# Altium schematic sheet POWER_GEN.SchDoc: =project_title
size Tabloid; CompanyName: Luxonis Holding; DrawnBy: Brian Weinstein / Sandesh Joshi/Dan Dunga; Organization: Luxonis Holding; Address1: 1925 Harmony Park Drive; Address2: Westminster, CO; Address3: 80234; Address4: United States; SheetNumber: 12; SheetTotal: 15
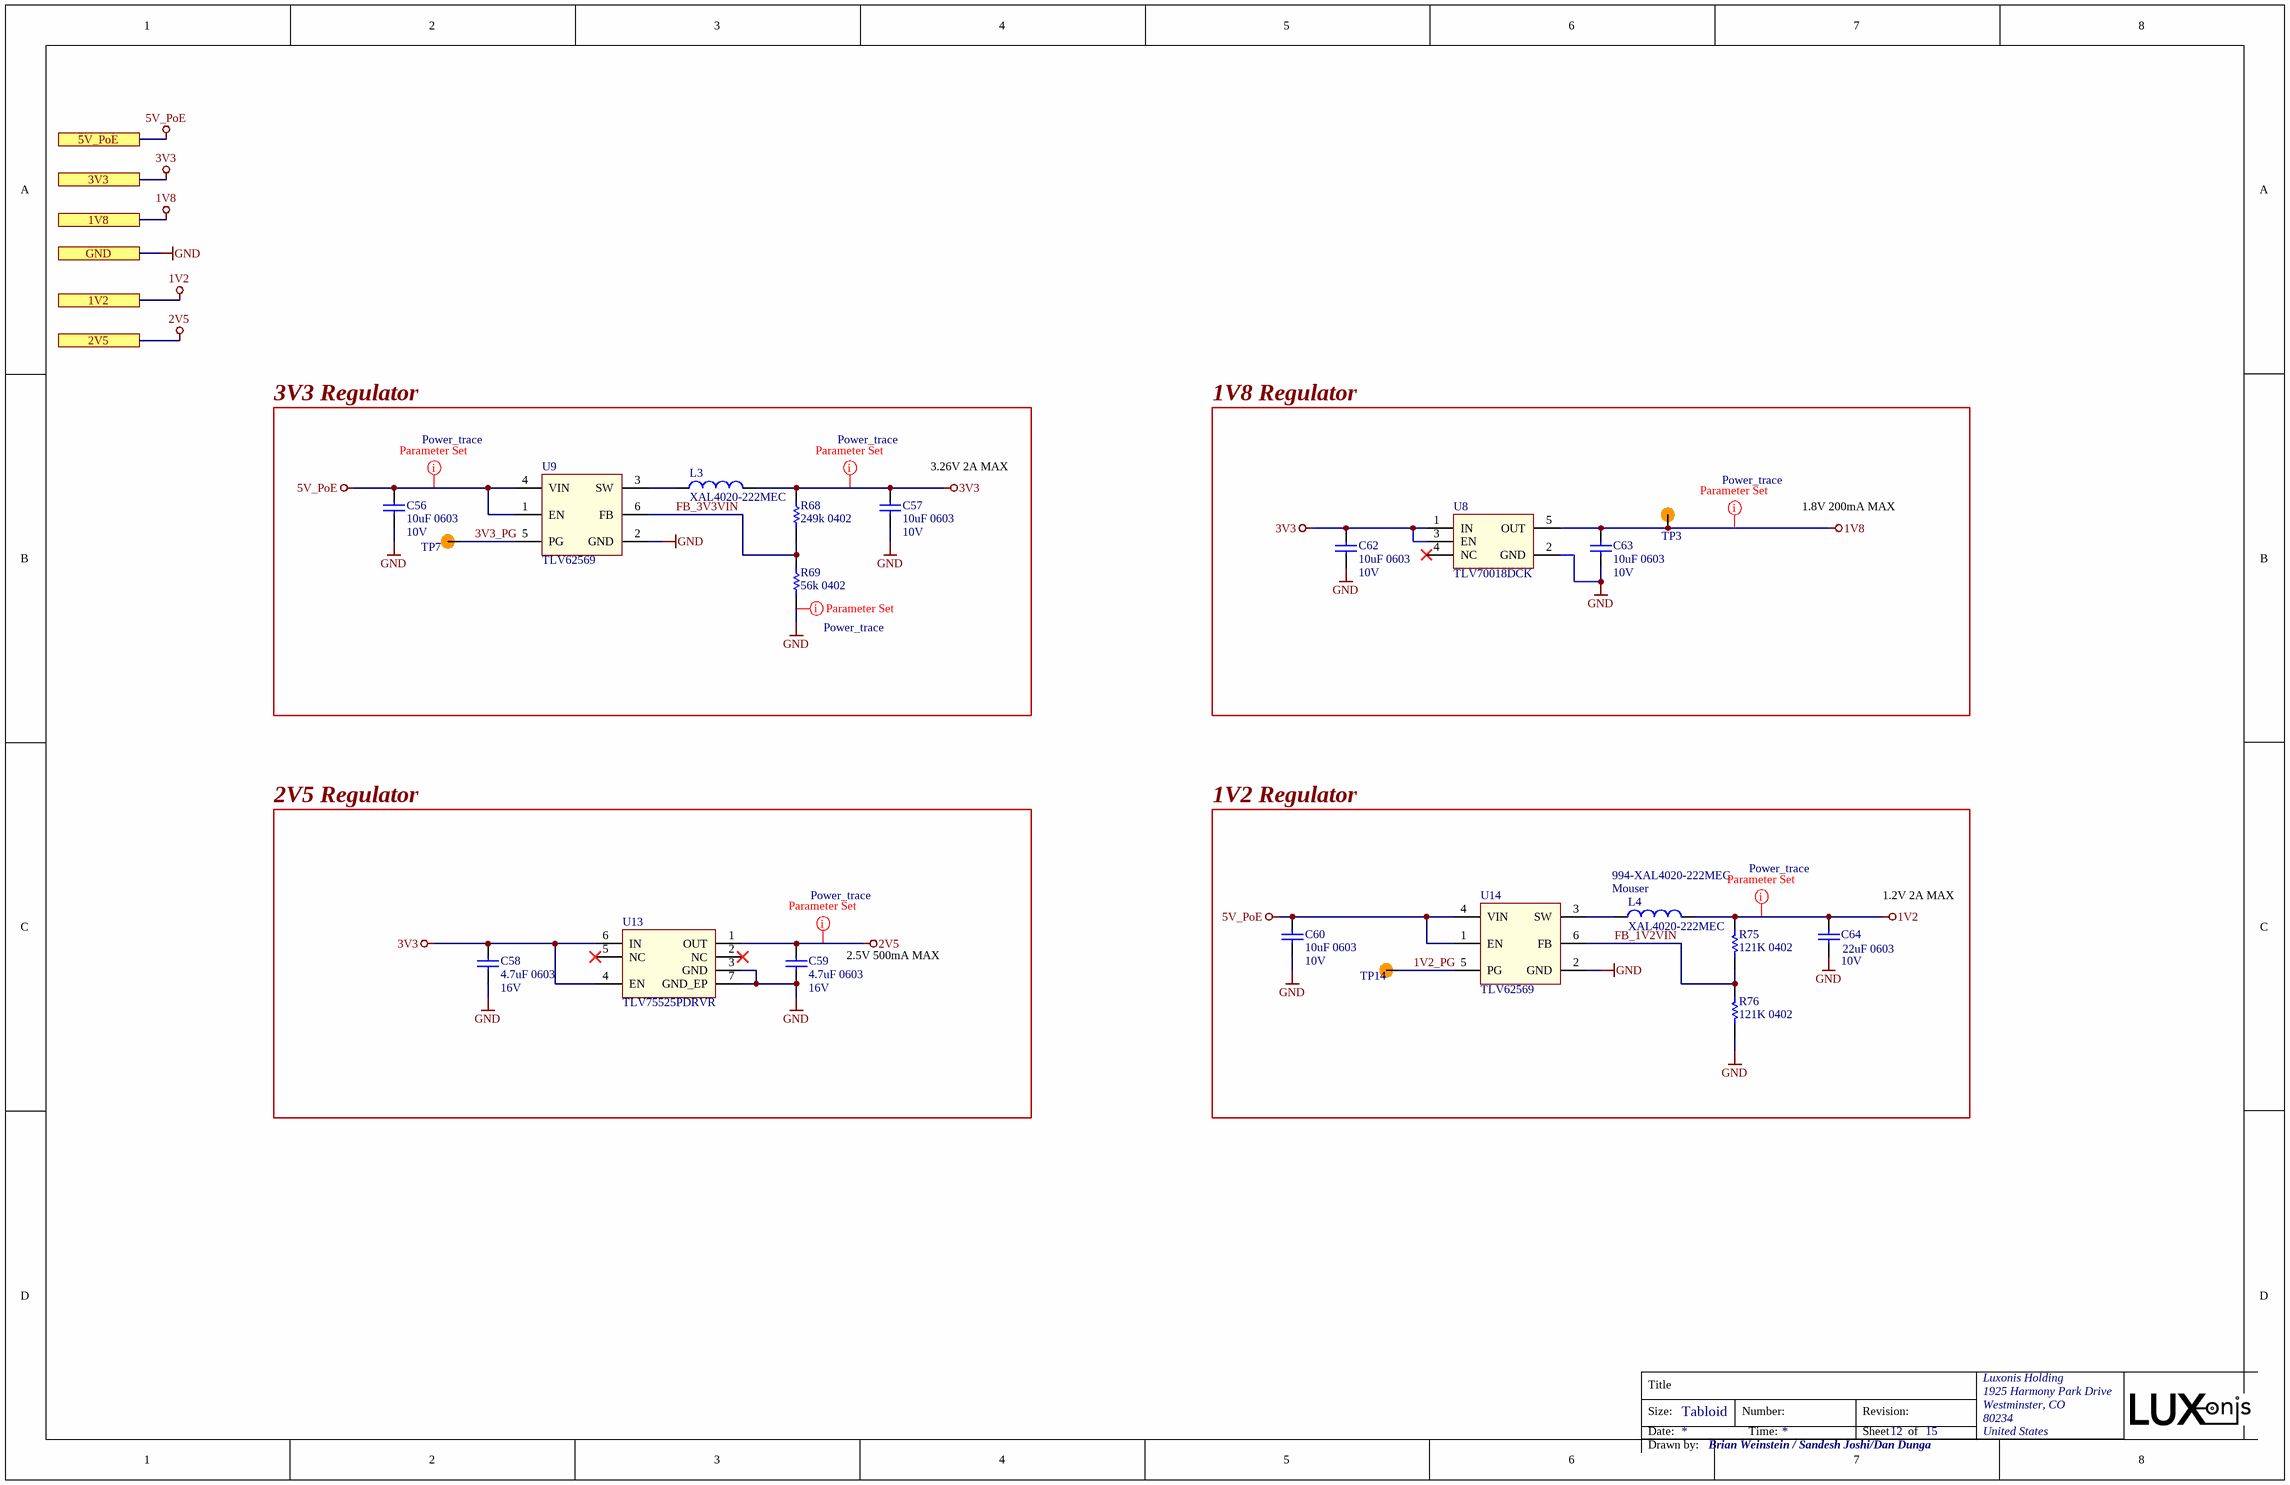
[diagram p0: POWER_GEN.SchDoc]

## Parts
C56  10uF 0603  Voltage Rating: 10V  [CAPC0603(1608)100_N]
C57  10uF 0603  Voltage Rating: 10V  [CAPC0603(1608)100_N]
C58  4.7uF 0603  Voltage Rating: 16V  [CAPC0603(1608)100_N]
C59  4.7uF 0603  Voltage Rating: 16V  [CAPC0603(1608)100_N]
C60  10uF 0603  Voltage Rating: 10V  [CAPC0603(1608)100_N]
C62  10uF 0603  Voltage Rating: 10V  [CAPC0603(1608)100_N]
C63  10uF 0603  Voltage Rating: 10V  [CAPC0603(1608)100_N]
C64  22uF 0603  Voltage Rating: 10V  [CAPC0603(1608)100_N]
L3  XAL4020-222MEC  [XAL4020]
L4  XAL4020-222MEC  Supplier 1: Mouser  Supplier Part Number 1: 994-XAL4020-222MEC  [XAL4020]
R68  249k 0402  [RESC0402(1005)_L]
R69  56k 0402  [RESC0402(1005)_L]
R75  121K 0402  [RESC0402(1005)_N]
R76  121K 0402  [RESC0402(1005)_N]
TP3  TP100_200_NS  [TP100_200_NS]  (value not drawn)  (no BOM)
TP7  TP100_200_NS  [TP100_200_NS]  (value not drawn)  (no BOM)
TP14  TP100_200_NS  [TP100_200_NS]  (value not drawn)  (no BOM)
U8  TLV70018DCK  [TLV70018DCK]
U9  TLV62569  [SOT236]
U13  TLV75525PDRVR  [WSON-6]
U14  TLV62569  [SOT236]

## Blocks framed on the sheet
3V3 Regulator: C56 C57 L3 R68 R69 TP7 U9
1V8 Regulator: C62 C63 TP3 U8
2V5 Regulator: C58 C59 U13
1V2 Regulator: C60 C64 L4 R75 R76 TP14 U14

## Ports
1V2, 1V8, 2V5, 3V3, 5V_PoE, GND

## Nets
1V2: C64.2 L4.2 R75.1 ; port 1V2
1V8: C63.2 TP3.1 U8.5(OUT) ; port 1V8
2V5: C59.2 U13.1(OUT) ; port 2V5
3V3: C57.2 C58.2 C62.2 L3.2 R68.2 U8.1(IN) U8.3(EN) U13.4(EN) U13.6(IN) ; port 3V3
5V_PoE: C56.2 C60.2 U9.1(EN) U9.4(VIN) U14.1(EN) U14.4(VIN) ; port 5V_PoE
GND: C56.1 C57.1 C58.1 C59.1 C60.1 C62.1 C63.1 C64.1 R69.1 R76.2 U8.2(GND) U9.2(GND) U13.3(GND) U13.7(GND_EP) U14.2(GND) ; port GND
1V2_PG: TP14.1 U14.5(PG)
3V3_PG: TP7.1 U9.5(PG)
FB_1V2VIN: R75.2 R76.1 U14.6(FB)
FB_3V3VIN: R68.1 R69.2 U9.6(FB)
NetL3_1: L3.1 U9.3(SW)
NetL4_1: L4.1 U14.3(SW)

Not connected (* = marked no-connect by the designer): U8 4(NC)*; U13 2(NC)* 5(NC)*

## Layout directives
net class Power_trace: 1V2, 1V8, 2V5, 3V3, 5V_PoE, GND

## Notes on the sheet
- (near C57) 3.26V 2A MAX
- 1.8V 200mA MAX
- 1.2V 2A MAX
- (near C59) 2.5V 500mA MAX
- Title
- Size:
- Date:
- Tabloid
- Number:
- Time:
- Revision:
- Sheet
- of
- Drawn by:

## Library data of the parts
C56 C57 C60 C62 C63 = GRM188R61A106ME69D: CAP CER 10UF 10V X5R 0603 20%; Manufacturer 1: Murata; Material: Ceramic; Supplier 1: Digi-Key; Manufacturer Part Number 1: GRM188R61A106ME69D; Stock 1: 2873098; Pricing 1: 1=0.21000, 10=0.14100, 100=0.07130, 500=0.04876, 1000=0.04313 (USD); RoHS: Yes; Mount: Surface Mount; Case/Package: 0603; Weight: 0.000222oz; Case Code (Metric): 1608; Case Code (Imperial): 0603; Min Operating Temperature: -55°C; Max Operating Temperature: 85°C; Packaging: Tape and Reel; Tolerance: 20%; Capacitance: 10uF; Dielectric: X5R; Voltage Rating (DC): 10V; Package Quantity: 4000; Termination: SMD/SMT; Length: 1.6mm; Height: 0.8mm; Width: 0.8mm; Thickness: 0.035inch; Depth: 0.8mm; REACH SVHC: Unknown; Lead Free: Lead Free; ComponentLink1URL: http://www.mouser.com/ds/2/281/c02e-2905.pdf?src-supplier=Mouser; ComponentLink1Description: http://www.mouser.com/ds/2/281/c02e-2905.pdf?src-supplier=Mouser; ComponentLink2URL: http://components.arrow.com/part/dataview/0323_06119472?src-supplier=Arrow+Europe; ComponentLink2Description: http://components.arrow.com/part/dataview/0323_06119472?src-supplier=Arrow+Europe; ComponentLink3URL: http://www.farnell.com/datasheets/2048014.pdf?src-supplier=Farnell; ComponentLink3Description: http://www.farnell.com/datasheets/2048014.pdf?src-supplier=Farnell; ComponentLink4URL: http://www.farnell.com/datasheets/1872210.pdf?src-supplier=Farnell; ComponentLink4Description: http://www.farnell.com/datasheets/1872210.pdf?src-supplier=Farnell; ComponentLink5URL: http://search.murata.co.jp/Ceramy/image/img/A01X/G101/ENG/GRM188R61A106ME69-01.pdf?src-supplier=Digi-Key; ComponentLink5Description: http://search.murata.co.jp/Ceramy/image/img/A01X/G101/ENG/GRM188R61A106ME69-01.pdf?src-supplier=Digi-Key; ComponentLink6URL: http://www.farnell.com/datasheets/1872210.pdf?src-supplier=Newark; ComponentLink6Description: http://www.farnell.com/datasheets/1872210.pdf?src-supplier=Newark; ComponentLink7URL: http://www.farnell.com/datasheets/2048014.pdf?src-supplier=Element14; ComponentLink7Description: http://www.farnell.com/datasheets/2048014.pdf?src-supplier=Element14; ComponentLink8URL: http://www.farnell.com/datasheets/2048014.pdf?src-supplier=Newark; ComponentLink8Description: http://www.farnell.com/datasheets/2048014.pdf?src-supplier=Newark; Supplier Part Number 1: 490-10475-1-ND
C58 C59 = GRM188R61C475KAAJD: CAP CER 4.7UF 16V X5R 0603 10%; Manufacturer 1: Murata; Material: Ceramic; Supplier 1: Digi-Key; Manufacturer Part Number 1: GRM188R61C475KAAJD; Stock 1: 455058; Pricing 1: 1=0.35000, 10=0.24600, 100=0.14730, 500=0.11050, 1000=0.09331 (USD); RoHS: Yes; Mount: Surface Mount; Case/Package: 0603; Weight: 0.000222oz; Case Code (Metric): 1608; Case Code (Imperial): 0603; Min Operating Temperature: -55°C; Max Operating Temperature: 85°C; Capacitance: 4.7uF; Tolerance: 10%; Packaging: Tape and Reel; Dielectric: X5R; Termination: SMD/SMT; Voltage Rating (DC): 16V; Package Quantity: 4000; Length: 1.6mm; Height: 0.8mm; Width: 0.8mm; Thickness: 0.037inch; Depth: 0.8mm; REACH SVHC: No SVHC; Lead Free: Lead Free; ComponentLink1URL: https://datasheet.ciiva.com/14813/595grm188r61c475kaaj23-14813668.pdf?src-supplier=Arrow; ComponentLink1Description: https://datasheet.ciiva.com/14813/595grm188r61c475kaaj23-14813668.pdf?src-supplier=Arrow; Supplier 2: Digi-Key; Manufacturer 2: Murata; Manufacturer Part Number 2: GRM188R61C475KAAJD; Stock 2: 455058; Pricing 2: 1=0.35000, 10=0.24600, 100=0.14730, 500=0.11050, 1000=0.09331 (USD); Supplier 3: Digi-Key; Manufacturer 3: Murata; Manufacturer Part Number 3: GRM188R61C475KAAJD; Stock 3: 452000; Pricing 3: 4000=0.07259, 8000=0.06832, 12000=0.06619, 28000=0.06405 (USD); Supplier Part Number 1: 490-10481-1-ND; Supplier Part Number 2: 490-10481-6-ND; Supplier Part Number 3: 490-10481-2-ND
C64 = GRM188R61A226ME15D: CAP CER 22UF 10V X5R 0603 20%; Manufacturer 1: Murata; Material: Ceramic; ComponentLink1URL: https://datasheet.ciiva.com/46444/1769893-46444975.pdf?src-supplier=Element14; ComponentLink1Description: https://datasheet.ciiva.com/46444/1769893-46444975.pdf?src-supplier=Element14; Supplier 1: Digi-Key; Manufacturer Part Number 1: GRM188R61A226ME15D; Stock 1: 984716; Pricing 1: 1=0.31000, 10=0.21500, 100=0.12160, 500=0.08584, 1000=0.07512 (USD); RoHS: Yes; Mount: Surface Mount; Case/Package: 0603; Weight: 0.000222oz; Case Code (Metric): 1608; Case Code (Imperial): 0603; Min Operating Temperature: -55°C; Max Operating Temperature: 85°C; Capacitance: 22uF; Tolerance: 20%; Packaging: Tape and Reel; Dielectric: X5R; Voltage Rating (DC): 10V; Termination: SMD/SMT; Package Quantity: 4000; Length: 1.6mm; Height: 0.8mm; Width: 0.8mm; Thickness: 0.039inch; Depth: 0.8mm; REACH SVHC: No SVHC; Lead Free: Lead Free; Supplier Part Number 1: 490-10476-1-ND
L3 L4 = XAL4020-222MEC: INDUCTOR, 2.2UH, 5.5A,20%,52MHZ, REEL; Manufacturer 1: Coilcraft; Core Material: Composite; Shielding: Shielded; DC Resistance (DCR): 38.7mR; Test Frequency: 100kHz; Saturation Current: 5.6A; Manufacturer Part Number 1: XAL4020-222MEC; RoHS: Yes; Category: Fixed Inductors; Stock 1: 45163; Pricing 1: 1=1.68000, 100=1.37000, 250=1.03000, 500=0.62000, 1000=0.48000, 3000=0.41000 (USD); Mount: Surface Mount; Case/Package: SMD/SMT; Min Operating Temperature: -40°C; Max Operating Temperature: 125°C; Packaging: Tape and Reel; Tolerance: 20%; Self Resonant Frequency: 52MHz; Inductance: 2.2uH; Max DC Current: 5.5A; Termination: SMD/SMT; Package Quantity: 1000; Inductance Tolerance: 20%; RMS Current (Irms): 5.5A; Series: XAL4020; Length: 4.3mm; Width: 4.3mm; Height: 2.1mm; Lead Free: Contains Lead; RoHS Compliant: Yes; REACH SVHC: Unknown; ComponentLink1URL: https://datasheet.ciiva.com/13277/xal4000-270751-13277338.pdf?src-supplier=Mouser; ComponentLink1Description: https://datasheet.ciiva.com/13277/xal4000-270751-13277338.pdf?src-supplier=Mouser; ComponentLink2URL: https://datasheet.ciiva.com/22680/1681987-22680732.pdf?src-supplier=Element14; ComponentLink2Description: https://datasheet.ciiva.com/22680/1681987-22680732.pdf?src-supplier=Element14; ComponentLink3URL: https://datasheet.ciiva.com/22680/1681987-22680733.pdf?src-supplier=Element14; ComponentLink3Description: https://datasheet.ciiva.com/22680/1681987-22680733.pdf?src-supplier=Element14
  L3: Supplier 1: Mouser; Supplier Part Number 1: 994-XAL4020-222MEC
R68 = CRCW0402249KFKED: RES SMD 249K OHM 1% 1/16W 0402; Manufacturer 1: Vishay; Resistance: 249kR; Temperature Coefficient: 100ppm/°C; Max Power Dissipation: 63mW; Voltage Rating (DC): 50V; Supplier 1: Digi-Key; Manufacturer Part Number 1: CRCW0402249KFKED; Stock 1: 241; Pricing 1: 1=0.10000, 10=0.03800, 100=0.01540, 1000=0.00690, 2500=0.00599, 5000=0.00495 (USD); RoHS: Yes; Case/Package: 0402; Weight: 2.3E-05oz; Case Code (Metric): 1005; Case Code (Imperial): 0402; Contact Plating: Tin; Min Operating Temperature: -55°C; Max Operating Temperature: 155°C; Tolerance: 1%; Packaging: Tape and Reel; Composition: Thick Film; Number of Terminations: 2; Package Quantity: 10; Power Rating: 63mW; Voltage Rating: 50V; Military Standard: Not; Features: Automotive AEC-Q200; Termination: SMD/SMT; Length: 1mm; Height: 0.35mm; Width: 0.02inch; Depth: 0.5mm; Lead Free: Lead Free; REACH SVHC: Unknown; ComponentLink1URL: https://datasheet.ciiva.com/11809/0900766b80d98824-11809983.pdf?src-supplier=RSComponents; ComponentLink1Description: https://datasheet.ciiva.com/11809/0900766b80d98824-11809983.pdf?src-supplier=RSComponents; ComponentLink2URL: https://datasheet.ciiva.com/22871/70201119-22871976.pdf?src-supplier=Allied+Electronics; ComponentLink2Description: https://datasheet.ciiva.com/22871/70201119-22871976.pdf?src-supplier=Allied+Electronics; ComponentLink3URL: https://datasheet.ciiva.com/22709/1697337-22709034.pdf?src-supplier=Element14; ComponentLink3Description: https://datasheet.ciiva.com/22709/1697337-22709034.pdf?src-supplier=Element14; ComponentLink4URL: https://datasheet.ciiva.com/7673/1697337-7673998.pdf?src-supplier=Element14; ComponentLink4Description: https://datasheet.ciiva.com/7673/1697337-7673998.pdf?src-supplier=Element14; ComponentLink5URL: https://datasheet.ciiva.com/2463/dcrcwe3-2463808.pdf?src-supplier=Digi-Key; ComponentLink5Description: https://datasheet.ciiva.com/2463/dcrcwe3-2463808.pdf?src-supplier=Digi-Key; ComponentLink6URL: https://datasheet.ciiva.com/2463/dcrcwe3-2463809.pdf?src-supplier=Digi-Key; ComponentLink6Description: https://datasheet.ciiva.com/2463/dcrcwe3-2463809.pdf?src-supplier=Digi-Key; ComponentLink7URL: https://datasheet.ciiva.com/5542/dcrcwe3-109170-5542680.pdf?src-supplier=Mouser; ComponentLink7Description: https://datasheet.ciiva.com/5542/dcrcwe3-109170-5542680.pdf?src-supplier=Mouser; ComponentLink8URL: https://datasheet.ciiva.com/16774/70201119-16774040.pdf?src-supplier=Allied+Electronics; ComponentLink8Description: https://datasheet.ciiva.com/16774/70201119-16774040.pdf?src-supplier=Allied+Electronics; ComponentLink9URL: https://datasheet.ciiva.com/7743/125364-7743531.pdf?src-supplier=Element14; ComponentLink9Description: https://datasheet.ciiva.com/7743/125364-7743531.pdf?src-supplier=Element14; ComponentLink10URL: https://datasheet.ciiva.com/7673/1697337-7673997.pdf?src-supplier=Element14; ComponentLink10Description: https://datasheet.ciiva.com/7673/1697337-7673997.pdf?src-supplier=Element14; Supplier 2: Digi-Key; Manufacturer 2: Vishay; Manufacturer Part Number 2: CRCW0402249KFKED; Stock 2: 241; Pricing 2: 1=0.10000, 10=0.03800, 100=0.01540, 1000=0.00690, 2500=0.00599, 5000=0.00495 (USD); Supplier Part Number 2: 541-249KLDKR-ND; Supplier Part Number 1: 541-249KLCT-ND
R69 = CRCW040256K0FKED: VISHAY - CRCW040256K0FKED - RES, THICK FILM, 56K, 1%, 0.063W, 0402; Resistance: 56kR; Power Rating: 63mW; Voltage Rating: 50V; Temperature Coefficient: 100ppm/°C; Manufacturer 1: Vishay; Manufacturer Part Number 1: CRCW040256K0FKED; RoHS: Yes; Category: Chip SMD Resistors; Stock 1: 180000; Pricing 1: 10000=0.00500 (USD); Mount: Surface Mount; Case/Package: 0402; Number of Pins: 2; Case Code (Metric): 1005; Case Code (Imperial): 0402; Contact Plating: Tin; Weight: 2.3E-05oz; Size Code: 0402; Min Operating Temperature: -55°C; Max Operating Temperature: 155°C; Package Quantity: 10; Tolerance: 1%; Packaging: Tape and Reel; Resistor Type: Thick Film; Termination: SMD/SMT; Voltage Rating (DC): 50V; Number of Terminations: 2; Max Power Dissipation: 63mW; Series: CRCW; Resistance Tolerance: 1%; Construction: Rectangular; Features: Automotive AEC-Q200; Technology: THICK FILM; Length: 1mm; Width: 0.02inch; Height: 0.35mm; Depth: 0.5mm; Radiation Hardening: No; REACH SVHC: Unknown; Military Standard: Not; RoHS Compliant: Yes; Lead Free: Lead Free; ComponentLink1URL: https://datasheet.ciiva.com/11811/0900766b80d98824-11811649.pdf?src-supplier=RSComponents; ComponentLink1Description: https://datasheet.ciiva.com/11811/0900766b80d98824-11811649.pdf?src-supplier=RSComponents; ComponentLink2URL: https://datasheet.ciiva.com/2525/dcrcwe3-2525584.pdf?src-supplier=Digi-Key; ComponentLink2Description: https://datasheet.ciiva.com/2525/dcrcwe3-2525584.pdf?src-supplier=Digi-Key; ComponentLink3URL: https://datasheet.ciiva.com/2525/dcrcwe3-2525585.pdf?src-supplier=Digi-Key; ComponentLink3Description: https://datasheet.ciiva.com/2525/dcrcwe3-2525585.pdf?src-supplier=Digi-Key; ComponentLink4URL: https://datasheet.ciiva.com/2525/dcrcwe3-2525586.pdf?src-supplier=Digi-Key; ComponentLink4Description: https://datasheet.ciiva.com/2525/dcrcwe3-2525586.pdf?src-supplier=Digi-Key; ComponentLink5URL: https://datasheet.ciiva.com/22683/1912744-22683285.pdf?src-supplier=Element14; ComponentLink5Description: https://datasheet.ciiva.com/22683/1912744-22683285.pdf?src-supplier=Element14; ComponentLink6URL: https://datasheet.ciiva.com/16941/dcrcwe3-16941275.pdf?src-supplier=Avnet+Europe; ComponentLink6Description: https://datasheet.ciiva.com/16941/dcrcwe3-16941275.pdf?src-supplier=Avnet+Europe; ComponentLink7URL: https://datasheet.ciiva.com/7841/1697337-7841532.pdf?src-supplier=Element14; ComponentLink7Description: https://datasheet.ciiva.com/7841/1697337-7841532.pdf?src-supplier=Element14; ComponentLink8URL: https://datasheet.ciiva.com/7841/1697337-7841533.pdf?src-supplier=Element14; ComponentLink8Description: https://datasheet.ciiva.com/7841/1697337-7841533.pdf?src-supplier=Element14; ComponentLink9URL: https://datasheet.ciiva.com/3256/dcrcwe3-3256654.pdf?src-supplier=Avnet; ComponentLink9Description: https://datasheet.ciiva.com/3256/dcrcwe3-3256654.pdf?src-supplier=Avnet; ComponentLink10URL: https://datasheet.ciiva.com/3256/dcrcwe3-3256655.pdf?src-supplier=Avnet; ComponentLink10Description: https://datasheet.ciiva.com/3256/dcrcwe3-3256655.pdf?src-supplier=Avnet; Supplier 1: Digi-Key; Supplier Part Number 1: 541-56.0KLCT-ND; Supplier 2: Digi-Key; Supplier Part Number 2: 541-56.0KLDKR-ND; Supplier 3: Digi-Key; Supplier Part Number 3: 541-56.0KLTR-ND
R75 R76 = RC0402FR-07121KL: RES SMD 121K OHM 1% 1/16W 0402; Manufacturer 1: Yageo; Resistance: 121kR; Temperature Coefficient: 100ppm/°C; Power Rating: 62.5mW; Voltage Rating: 50V; Max Power Dissipation: 63mW; Supplier 1: Digi-Key; Manufacturer Part Number 1: RC0402FR-07121KL; Stock 1: 412120; Pricing 1: 1=0.10000, 10=0.01600, 100=0.00640, 1000=0.00289, 2500=0.00251, 5000=0.00207 (USD); RoHS: Yes; Case/Package: 0402; Case Code (Imperial): 0402; Case Code (Metric): 1005; Min Operating Temperature: -55°C; Max Operating Temperature: 155°C; Packaging: Tape and Reel; Tolerance: 1%; Package Quantity: 1; Composition: Thick Film; Termination: SMD/SMT; Number of Terminations: 2; Voltage Rating (DC): 50V; Features: Moisture Resistant; Military Standard: Not; Working Voltage: 50V; Length: 1mm; Height: 0.016inch; Width: 0.5mm; Depth: 0.5mm; Lead Free: Lead Free; REACH SVHC: No SVHC; ComponentLink1URL: https://datasheet.ciiva.com/2453/pyu-r-int-thick-7-2453445.pdf?src-supplier=Digi-Key; ComponentLink1Description: https://datasheet.ciiva.com/2453/pyu-r-int-thick-7-2453445.pdf?src-supplier=Digi-Key; ComponentLink2URL: https://datasheet.ciiva.com/2453/pyu-r-int-thick-7-2453446.pdf?src-supplier=Digi-Key; ComponentLink2Description: https://datasheet.ciiva.com/2453/pyu-r-int-thick-7-2453446.pdf?src-supplier=Digi-Key; ComponentLink3URL: https://datasheet.ciiva.com/2453/pyu-r-int-thick-7-2453447.pdf?src-supplier=Digi-Key; ComponentLink3Description: https://datasheet.ciiva.com/2453/pyu-r-int-thick-7-2453447.pdf?src-supplier=Digi-Key; Supplier 2: Newark; Supplier 3: Mouser; Supplier Part Number 1: 311-121KLRCT-ND; Supplier Part Number 3: 603-RC0402FR-07121KL; Supplier Part Number 2: 67R9895
TP3 TP7 TP14 = TEST_POINT
U8 = TLV70018DCK: IC REG LINEAR 1.8V 200MA SC70-5 Linear Voltage Regulator IC  1 Output  200mA SC-70-5; Manufacturer 1: Texas Instruments; Manufacturer Part Number 1: TLV70018DCKR; Max Power Dissipation: 320mW; Number of Outputs: 1; Dropout Voltage: 175mV; Max Input Voltage: 5.5V; Min Input Voltage: 2V; Min Current Limit: 220mA; Polarity: Positive; Output Voltage Accuracy: 2%; Quiescent Current: 30uA; Output Type: Fixed; Nominal Supply Current: 31uA; Supplier 1: Digi-Key; Stock 1: 63905; Pricing 1: 1=0.48000, 10=0.40900, 100=0.30570, 500=0.24020, 1000=0.18561 (USD); RoHS: Yes; Case/Package: SC; Number of Pins: 5; Contact Plating: Gold; Min Operating Temperature: -40°C; Max Operating Temperature: 125°C; Packaging: Tape and Reel; Package Quantity: 1; Output Voltage: 1.8V; Output Current: 200mA; Max Output Current: 200mA; Number of Regulators: 1; Power Dissipation: 320mW; Nominal Output Voltage: 1.8V; Accuracy: 2%; Max Output Voltage: 1.8V; Min Output Voltage: 1.8V; REACH SVHC: No SVHC; Lead Free: Lead Free; ComponentLink1URL: https://datasheet.ciiva.com/41462/001014631-da-01-en-ic-reg-ldo-1-8v-0-tlv70018dckr-sot-5-tid-41462480.pdf?src-supplier=Conrad; ComponentLink1Description: https://datasheet.ciiva.com/41462/001014631-da-01-en-ic-reg-ldo-1-8v-0-tlv70018dckr-sot-5-tid-41462480.pdf?src-supplier=Conrad; Supplier 2: Digi-Key; Manufacturer 2: Texas Instruments; Manufacturer Part Number 2: TLV70018DCKT; Stock 2: 13188; Pricing 2: 1=0.55000, 10=0.46700, 100=0.34900 (USD); Power Rating: 320mW; Length: 2.15mm; Height: 1mm; Width: 1.4mm; Radiation Hardening: No; ComponentLink2URL: https://datasheet.ciiva.com/22700/1882059-22700171.pdf?src-supplier=Element14; ComponentLink2Description: https://datasheet.ciiva.com/22700/1882059-22700171.pdf?src-supplier=Element14; ComponentLink3URL: https://datasheet.ciiva.com/14149/tlv700-eng-ds-14149837.pdf?src-supplier=Distrelec; ComponentLink3Description: https://datasheet.ciiva.com/14149/tlv700-eng-ds-14149837.pdf?src-supplier=Distrelec; ComponentLink4URL: https://datasheet.ciiva.com/7992/1882059-7992894.pdf?src-supplier=Element14; ComponentLink4Description: https://datasheet.ciiva.com/7992/1882059-7992894.pdf?src-supplier=Element14; Supplier Part Number 1: 296-32409-1-ND; Supplier Part Number 2: 296-25269-1-ND
U9 U14 = TLV62569PDDCT: 2-A HIGH EFFICIENCY STEP-DOWN CO; Manufacturer 1: Texas Instruments; Output Type: Adjustable; Output Configuration: Positive; Min Input Voltage: 2.5V; Max Input Voltage: 5.5V; Min Output Voltage: 600mV; Output Current: 2A; Switching Frequency: 1.5MHz; Synchronous Rectifier: Yes; Manufacturer Part Number 1: TLV62569PDDCT; RoHS: Yes; Category: Power Supply Modules; Stock 1: 3900; Pricing 1: 1=0.68000, 10=0.59500, 25=0.55880, 100=0.45590 (USD); Mount: Surface Mount; Case/Package: SOT-23-6; Min Operating Temperature: -40°C; Max Operating Temperature: 125°C; Packaging: Cut Tape; Max Output Voltage: 5.5V; RoHS Compliant: Yes; ComponentLink1URL: http://www.ti.com/lit/ds/symlink/tlv62569.pdf?src-supplier=Digi-Key; ComponentLink1Description: http://www.ti.com/lit/ds/symlink/tlv62569.pdf?src-supplier=Digi-Key; Supplier 1: Digi-Key; Supplier Part Number 1: 296-47088-1-ND; Supplier 2: Digi-Key; Supplier Part Number 2: 296-47088-6-ND
U13 = TLV75525PDRVR: 500-mA, high-PSRR, low-IQ, low-dropout voltage regulator with enable 6-WSON -40 to 125; Manufacturer 1: Texas Instruments; Output Type: Fixed; Output Configuration: Positive; Number of Regulators: 1; Max Input Voltage: 5.5V; Min Output Voltage: 2.5V; Max Output Voltage: 3.3V; Dropout Voltage: 325mV; Output Current: 500mA; Quiescent Current: 31uA; Power Supply Rejection Ratio (PSRR): 52dB; Manufacturer Part Number 1: TLV75525PDRVR; RoHS: Yes; Category: Integrated Circuits (ICs); Stock 1: 74350; Pricing 1: 1=0.28700, 100=0.19500, 250=0.15100, 1000=0.10000 (USD); Mount: Surface Mount; Min Operating Temperature: -40°C; Max Operating Temperature: 125°C; Packaging: Tape and Reel; RoHS Compliant: Yes; ComponentLink1URL: http://www.ti.com/lit/gpn/tlv755p?src-supplier=Digi-Key; ComponentLink1Description: http://www.ti.com/lit/gpn/tlv755p?src-supplier=Digi-Key; Supplier 1: Arrow Electronics; Supplier Part Number 1: TLV75525PDRVR; Supplier 2: Mouser; Supplier Part Number 2: 595-TLV75525PDRVR